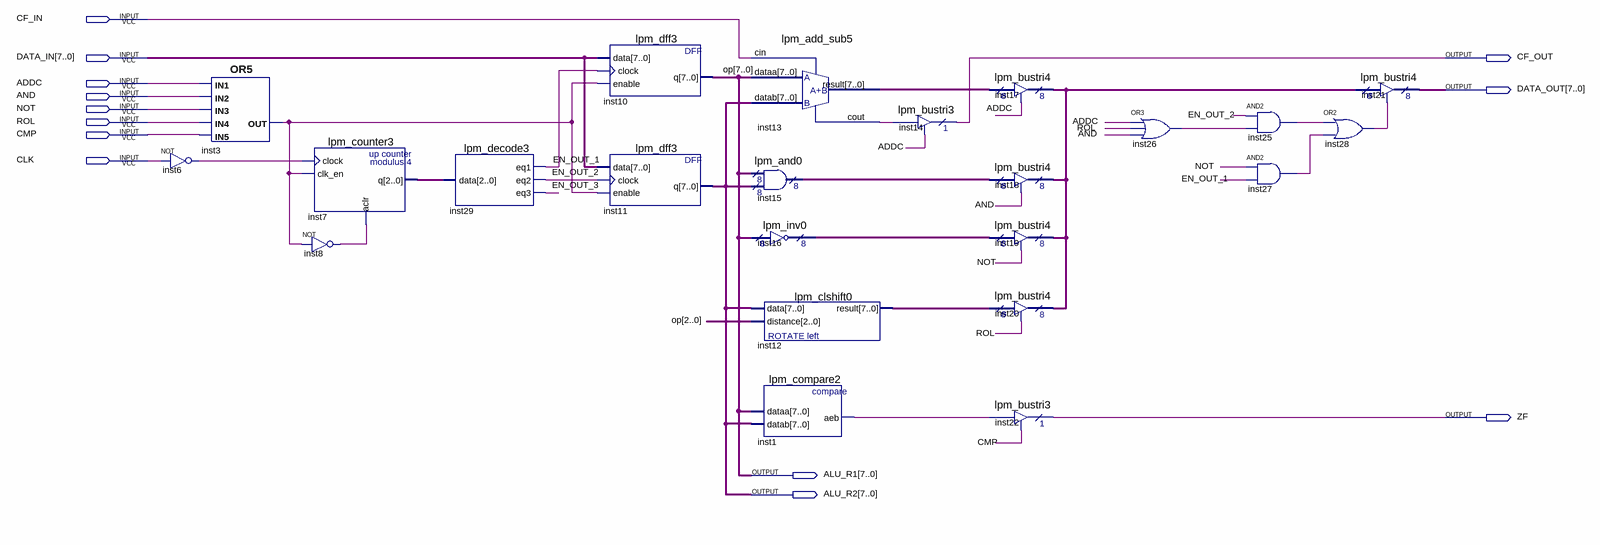
[diagram p0: schematic sheet]
// Quartus schematic ALU.bdf as structural Verilog: 23 symbols, 13 pins
module ALU (
  input  CF_IN,
  input  [7:0] DATA_IN,
  input  ADDC,
  input  AND,
  input  NOT,
  input  ROL,
  input  CMP,
  input  CLK,
  output CF_OUT,
  output [7:0] DATA_OUT,
  output ZF,
  output [7:0] ALU_R1,
  output [7:0] ALU_R2
);

  wire EN_OUT_1, EN_OUT_2, EN_OUT_3, inst1_aeb, inst3_out, inst6_out, inst8_out, inst13_cout, inst25_out,
       inst26_out, inst27_out, inst28_out;
  wire [2:0] inst7_q;
  wire [7:0] inst12_result, inst13_result, inst15_result, inst16_result, inst17_tridata;

  or inst3 (inst3_out, ADDC, AND, NOT, ROL, CMP);
  not inst6 (inst6_out, CLK);
  lpm_counter3 inst7 (.clock(inst6_out), .clk_en(inst3_out), .aclr(inst8_out), .q(inst7_q));
  not inst8 (inst8_out, inst3_out);
  lpm_decode3 inst29 (.data(inst7_q), .eq1(EN_OUT_1), .eq2(EN_OUT_2), .eq3(EN_OUT_3));
  lpm_dff3 inst10 (.data(DATA_IN), .clock(EN_OUT_1), .enable(inst3_out), .q(ALU_R1));
  lpm_dff3 inst11 (.data(DATA_IN), .clock(EN_OUT_2), .enable(inst3_out), .q(ALU_R2));
  lpm_add_sub5 inst13 (.dataa(ALU_R1), .datab(ALU_R2), .cin(CF_IN), .result(inst13_result), .cout(inst13_cout));
  lpm_and0 inst15 (.data0x(ALU_R1), .data1x(ALU_R2), .result(inst15_result));
  lpm_inv0 inst16 (.data(ALU_R1), .result(inst16_result));
  lpm_clshift0 inst12 (.data(ALU_R2), .distance(ALU_R1[2:0]), .result(inst12_result));
  lpm_compare2 inst1 (.dataa(ALU_R1), .datab(ALU_R2), .aeb(inst1_aeb));
  lpm_bustri3 inst14 (.enabledt(ADDC), .data(inst13_cout), .tridata(CF_OUT));
  lpm_bustri4 inst17 (.enabledt(ADDC), .data(inst13_result), .tridata(inst17_tridata));
  lpm_bustri4 inst18 (.enabledt(AND), .data(inst15_result), .tridata(inst17_tridata));
  lpm_bustri4 inst19 (.enabledt(NOT), .data(inst16_result), .tridata(inst17_tridata));
  lpm_bustri4 inst20 (.enabledt(ROL), .data(inst12_result), .tridata(inst17_tridata));
  lpm_bustri3 inst22 (.enabledt(CMP), .data(inst1_aeb), .tridata(ZF));
  or inst26 (inst26_out, ADDC, ROL, AND);
  and inst25 (inst25_out, EN_OUT_2, inst26_out);
  and inst27 (inst27_out, NOT, EN_OUT_1);
  or inst28 (inst28_out, inst25_out, inst27_out);
  lpm_bustri4 inst21 (.enabledt(inst28_out), .data(inst17_tridata), .tridata(DATA_OUT));

  // Other names for the same wires on the sheet: op[7:0] = ALU_R1
endmodule
